# Altium schematic sheet L PCB Schematic.SchDoc
size A4; SheetNumber: 1; SheetTotal: 1
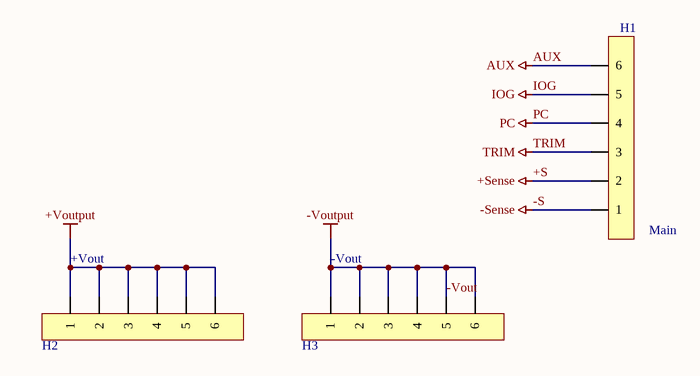
[diagram p0: L PCB Schematic.SchDoc]

## Parts
H1  Main  [Main]
H2  +Vout  [+/- Voutput]
H3  -Vout  [+/- Voutput]

## Nets
+S: H1.?2(2)  [also labelled +Sense]
+Voutput: H2.?1(1) H2.?2(2) H2.?3(3) H2.?4(4) H2.?5(5) H2.?6(6)
-S: H1.?1(1)  [also labelled -Sense]
-Vout: H3.?1(1) H3.?2(2) H3.?3(3) H3.?4(4) H3.?5(5) H3.?6(6)  [also labelled -Voutput]
AUX: H1.?6(6)
IOG: H1.?5(5)
PC: H1.?4(4)
TRIM: H1.?3(3)

## Library data of the parts
H1 = Main: PH Series 6 Position Through Hole Single Row Straight .100 Header; Manufacturer: Adam Equipment; Manufacturer Part Number: PH1-06-UA; Number of Positions: 6; Pitch: 2.54mm; Supplier: Digi-Key; Supplier Part Number: 2057-PH1-06-UA-ND; RoHS: Yes; Category: Connectors; Stock: 25838; Pricing: 1=0.13000, 10=0.09900, 100=0.07320, 500=0.06060, 1000=0.05302, 5000=0.04545, 10000=0.04419 (USD); Mounting Technology: Through Hole; Contact Plating: Gold; Number of Contacts: 6; Packaging: Bag; Number of Rows: 1; Lead Free: Lead Free; ComponentLink1URL: http://www.adam-tech.com/catalog/2012/page_312-315.pdf?src-supplier=Future+Electronics; ComponentLink1Description: http://www.adam-tech.com/catalog/2012/page_312-315.pdf?src-supplier=Future+Electronics; Supplier 1: Digi-Key; Supplier Part Number 1: 2057-PH1-06-UA-ND
H2 H3 = +/- Voutput: PH Series 6 Position Through Hole Single Row Straight .100 Header; Manufacturer: Adam Equipment; Manufacturer Part Number: PH1-06-UA; Number of Positions: 6; Pitch: 2.54mm; Supplier: Digi-Key; Supplier Part Number: 2057-PH1-06-UA-ND; RoHS: Yes; Category: Connectors; Stock: 25838; Pricing: 1=0.13000, 10=0.09900, 100=0.07320, 500=0.06060, 1000=0.05302, 5000=0.04545, 10000=0.04419 (USD); Mounting Technology: Through Hole; Contact Plating: Gold; Number of Contacts: 6; Packaging: Bag; Number of Rows: 1; Lead Free: Lead Free; ComponentLink1URL: http://www.adam-tech.com/catalog/2012/page_312-315.pdf?src-supplier=Future+Electronics; ComponentLink1Description: http://www.adam-tech.com/catalog/2012/page_312-315.pdf?src-supplier=Future+Electronics; Supplier 1: Digi-Key; Supplier Part Number 1: 2057-PH1-06-UA-ND